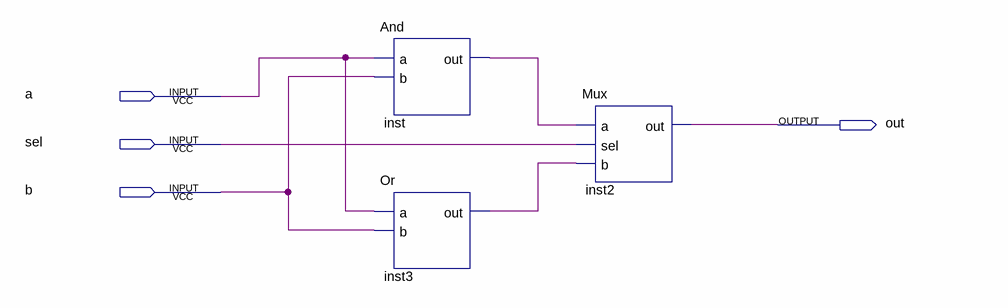
[diagram p0: schematic sheet]
// Quartus schematic AndMuxOr.bdf as structural Verilog: 3 symbols, 4 pins
module AndMuxOr (
  input  a,
  input  sel,
  input  b,
  output out
);

  wire inst3_out, inst_out;

  And inst (.a(a), .b(b), .out(inst_out));
  Or inst3 (.a(a), .b(b), .out(inst3_out));
  Mux inst2 (.a(inst_out), .sel(sel), .b(inst3_out), .out(out));
endmodule
